# Altium project FIT_TCM.PrjPcb (part 9 of 9)
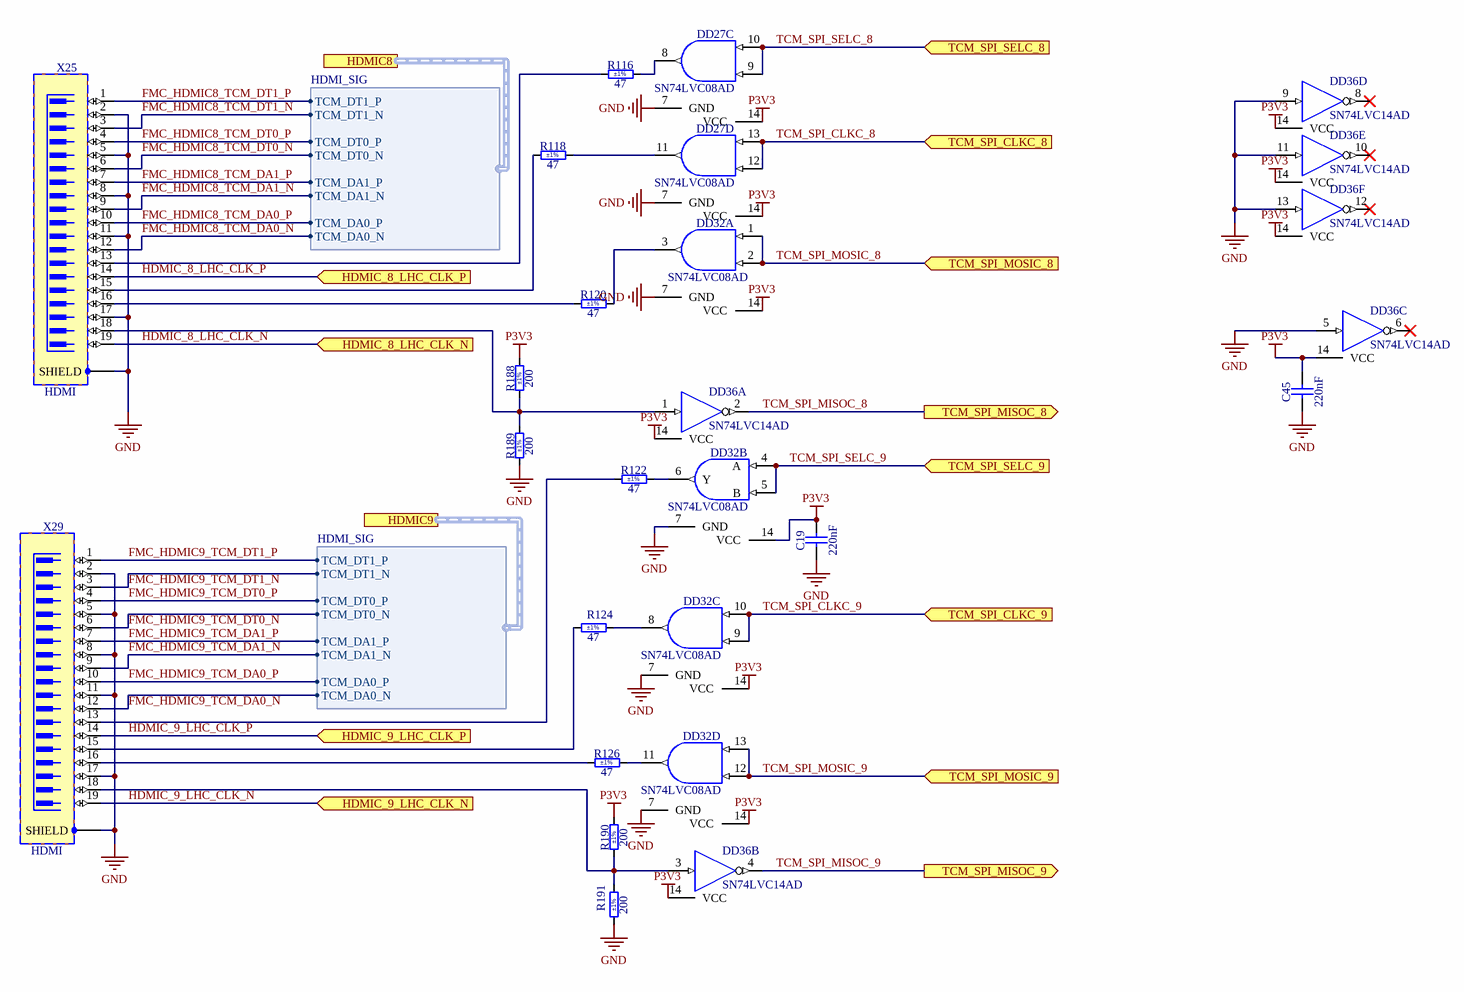
[diagram p32: FIT_HDMI_X25-29.SchDoc]

## Nets that join several sheets
GND: FIT_TCM_ATxmega (18 pins), FIT_TCM_Main_PLL (23 pins), FIT_TCM_ADCLK854 (32 pins), FIT_TCM_SI5338A (15 pins), FIT_TCM_LDO (28 pins), FIT_TCM_LOGIC (11 pins), FIT_TCM_P1V0 (15 pins), FIT_TCM_P1V8 (19 pins), FIT_TCM_P3V3 (27 pins), FIT_TCM_RJ45 (14 pins), FIT_TCM_SFP_PLUS (96 pins), FIT_TCM_LEMO_OUT (15 pins), FIT_FPGA_A-C (81 pins), FIT_FPGA_I-J-K (9 pins), FIT_FPGA_POWER (141 pins), FIT_HDMI_X19-9 (19 pins), FIT_HDMI_X32-26 (19 pins), FIT_HDMI_X22-18 (19 pins), FIT_HDMI_X31-7 (18 pins), FIT_HDMI_X27-23 (18 pins), FIT_HDMI_X21-17 (20 pins), FIT_HDMI_X34-28 (19 pins), FIT_HDMI_X24-20 (18 pins), FIT_HDMI_X16-33 (20 pins), FIT_HDMI_X25-29 (23 pins)
P1V0: FIT_TCM_P1V0 (R74.2), FIT_FPGA_POWER (27 pins)
P1V0_LDO: FIT_TCM_LDO (C78.2 R53.2), FIT_FPGA_POWER (5 pins)
P1V2_LDO: FIT_TCM_LDO (C84.2 R55.2), FIT_FPGA_I-J-K (DD6.M5 R24.1), FIT_FPGA_POWER (7 pins)
P1V8: FIT_TCM_ADCLK854 (20 pins), FIT_TCM_P1V8 (R84.2), FIT_FPGA_POWER (32 pins)
P1V8_2: FIT_TCM_LDO (L7.1), FIT_TCM_P1V8 (7 pins)
P1V8_LDO: FIT_TCM_LDO (R56.2), FIT_FPGA_POWER (C86.2 DD6.N6)
P2V5: FIT_TCM_LDO (R3.2), FIT_FPGA_POWER (7 pins)
P3V3: FIT_TCM_ATxmega (12 pins), FIT_TCM_Main_PLL (6 pins), FIT_TCM_SI5338A (6 pins), FIT_TCM_P3V3 (R92.2), FIT_TCM_RJ45 (C16.2 C27.2 DD45.8), FIT_TCM_SFP_PLUS (9 pins), FIT_TCM_LEMO_OUT (10 pins), FIT_FPGA_A-C (8 pins), FIT_FPGA_I-J-K (6 pins), FIT_FPGA_POWER (31 pins), FIT_HDMI_X19-9 (7 pins), FIT_HDMI_X32-26 (7 pins), FIT_HDMI_X22-18 (7 pins), FIT_HDMI_X31-7 (6 pins), FIT_HDMI_X27-23 (6 pins), FIT_HDMI_X21-17 (8 pins), FIT_HDMI_X34-28 (7 pins), FIT_HDMI_X24-20 (6 pins), FIT_HDMI_X16-33 (8 pins), FIT_HDMI_X25-29 (7 pins)
P3V3_2: FIT_TCM_LDO (C5.2 DA1.2 L8.1), FIT_TCM_P3V3 (7 pins)
P3V3_LDO: FIT_TCM_ATxmega (20 pins), FIT_TCM_P3V3 (C254.1 DA25.3), FIT_TCM_RJ45 (C61.1 C261.2 DD7.16)
VIN_P5V0: FIT_TCM_Main_PLL (R204.1), FIT_TCM_LDO (9 pins), FIT_TCM_LOGIC (11 pins), FIT_TCM_P1V0 (8 pins), FIT_TCM_P1V8 (11 pins), FIT_TCM_P3V3 (15 pins), FIT_TCM_RJ45 (C28.2 DD46.14 X36.1)
BUCK_SYNC: FIT_TCM_P1V0 (DA11.1), FIT_TCM_P1V8 (DA12.1 R73.2), FIT_TCM_P3V3 (DA13.1)
C_N: FIT_TCM_LEMO_OUT (DD40.3), FIT_FPGA_E_G-H (DD6.AF2)
C_P: FIT_TCM_LEMO_OUT (DD40.2), FIT_FPGA_E_G-H (DD6.AF3)
CFG_CCLK: FIT_TCM_ATxmega (DD9.6 R193.2), FIT_FPGA_I-J-K (DD6.C8)
CFG_DIN_DQ1: FIT_TCM_ATxmega (DD5.42 DD9.2), FIT_FPGA_A-C (DD6.A25)
CFG_DQ2: FIT_TCM_ATxmega (DD9.3 R36.1), FIT_FPGA_A-C (DD6.B22)
CFG_DQ3: FIT_TCM_ATxmega (DD9.7 R30.1), FIT_FPGA_A-C (DD6.A22)
CFG_FCS: FIT_TCM_ATxmega (DD5.40 DD9.1 R26.1), FIT_FPGA_A-C (DD6.C23)
CFG_MOSI_DQ0: FIT_TCM_ATxmega (DD5.41 DD9.5), FIT_FPGA_A-C (DD6.B24)
CLKA_IN_N: FIT_TCM_ADCLK854 (DD20.2 R127.1), FIT_TCM_SI5338A (DD15.17)
CLKA_IN_P: FIT_TCM_ADCLK854 (DD20.3 R127.2), FIT_TCM_SI5338A (DD15.18)
CLKA_N: FIT_TCM_ADCLK854 (DD20.15), FIT_FPGA_E_G-H (DD6.AC2)
CLKA_P: FIT_TCM_ADCLK854 (DD20.16), FIT_FPGA_E_G-H (DD6.AB2)
CLKC_IN_N: FIT_TCM_ADCLK854 (DD23.2 R172.1), FIT_TCM_SI5338A (DD15.13)
CLKC_IN_P: FIT_TCM_ADCLK854 (DD23.3 R172.2), FIT_TCM_SI5338A (DD15.14)
CLKC_N: FIT_TCM_ADCLK854 (DD23.15), FIT_FPGA_B-F (DD6.N23)
CLKC_P: FIT_TCM_ADCLK854 (DD23.16), FIT_FPGA_B-F (DD6.P23)
EN_P1V0: FIT_TCM_LOGIC (DD11.3 DD11.5 DD11.9 DD11.12), FIT_TCM_P1V0 (DA11.3)
EN_P1V0LDO_P3V3: FIT_TCM_LDO (DA3.1), FIT_TCM_LOGIC (DD11.11), FIT_TCM_P3V3 (DA13.3)
EN_P1V8: FIT_TCM_LOGIC (DD11.6), FIT_TCM_P1V8 (DA12.3)
EN_P2V5_P1V8LDO_P1V2LDO: FIT_TCM_LDO (DA1.1 DA4.1 DA5.1), FIT_TCM_LOGIC (DD11.8)
EN_PSU: FIT_TCM_ATxmega (DD5.38), FIT_TCM_LOGIC (DD11.1 DD12.4 R150.2)
ETH_RX_N: FIT_TCM_SFP_PLUS (DD41.12), FIT_FPGA_I-J-K (DD6.N3)
ETH_RX_P: FIT_TCM_SFP_PLUS (DD41.13), FIT_FPGA_I-J-K (DD6.N4)
ETH_TX_N: FIT_TCM_SFP_PLUS (DD41.19), FIT_FPGA_I-J-K (DD6.M1)
ETH_TX_P: FIT_TCM_SFP_PLUS (DD41.18), FIT_FPGA_I-J-K (DD6.M2)
EXT_CLK0_INTR: FIT_TCM_ATxmega (DD5.19 DD47.2 R132.1), FIT_TCM_SI5338A (DD15.8)
EXT_CLK0_N: FIT_TCM_Main_PLL (DD16.4), FIT_TCM_SI5338A (C8.1 R152.1)
EXT_CLK0_P: FIT_TCM_Main_PLL (DD16.5), FIT_TCM_SI5338A (C7.1 R152.2)
EXT_CLK0_STATUS: FIT_TCM_ATxmega (DD5.51), FIT_TCM_Main_PLL (DD16.9)
EXT_CLK1_INTR: FIT_TCM_ATxmega (DD5.18 DD47.1 R48.1), FIT_TCM_SI5338A (DD17.8)
EXT_CLK1_N: FIT_TCM_Main_PLL (DD16.31), FIT_TCM_SI5338A (C2.1 R4.1)
EXT_CLK1_P: FIT_TCM_Main_PLL (DD16.32), FIT_TCM_SI5338A (C1.1 R4.2)
EXT_CLK1_STATUS: FIT_TCM_ATxmega (DD5.50), FIT_TCM_Main_PLL (DD16.16)
EXT_CLK_IN_0_N: FIT_TCM_Main_PLL (DD16.11 R52.1), FIT_TCM_SFP_PLUS (DD14.12)
EXT_CLK_IN_0_P: FIT_TCM_Main_PLL (DD16.10 R52.2), FIT_TCM_SFP_PLUS (DD14.13)
EXT_CLK_SEL: FIT_TCM_ATxmega (DD5.20), FIT_TCM_Main_PLL (DD16.8)
FPGA_DONE: FIT_TCM_ATxmega (DD5.31 R23.1), FIT_TCM_LOGIC (DD13.9 DD13.10), FIT_FPGA_I-J-K (DD6.J7)
FPGA_INIT_B: FIT_TCM_ATxmega (DD5.30 R22.1), FIT_FPGA_I-J-K (DD6.G7)
FPGA_PROGRAM_B: FIT_TCM_ATxmega (DD5.27 R21.1), FIT_FPGA_I-J-K (DD6.P6)
FPGA_RST: FIT_TCM_ATxmega (DD5.13), FIT_FPGA_A-C (DD6.B21)
GBT_RX_N: FIT_TCM_SFP_PLUS (DD8.12), FIT_FPGA_I-J-K (DD6.R3)
GBT_RX_P: FIT_TCM_SFP_PLUS (DD8.13), FIT_FPGA_I-J-K (DD6.R4)
GBT_TX_N: FIT_TCM_SFP_PLUS (DD8.19), FIT_FPGA_I-J-K (DD6.P1)
GBT_TX_P: FIT_TCM_SFP_PLUS (DD8.18), FIT_FPGA_I-J-K (DD6.P2)
HDMIA0.TCM_DA0_N: FIT_FPGA_E_G-H (DD6.V7), FIT_HDMI_X31-7 (X31.12)
HDMIA0.TCM_DA0_P: FIT_FPGA_E_G-H (DD6.V8), FIT_HDMI_X31-7 (X31.10)
HDMIA0.TCM_DA1_N: FIT_FPGA_E_G-H (DD6.W9), FIT_HDMI_X31-7 (X31.9)
HDMIA0.TCM_DA1_P: FIT_FPGA_E_G-H (DD6.W10), FIT_HDMI_X31-7 (X31.7)
HDMIA0.TCM_DT0_N: FIT_FPGA_E_G-H (DD6.U1), FIT_HDMI_X31-7 (X31.6)
HDMIA0.TCM_DT0_P: FIT_FPGA_E_G-H (DD6.U2), FIT_HDMI_X31-7 (X31.4)
HDMIA0.TCM_DT1_N: FIT_FPGA_E_G-H (DD6.U5), FIT_HDMI_X31-7 (X31.3)
HDMIA0.TCM_DT1_P: FIT_FPGA_E_G-H (DD6.U6), FIT_HDMI_X31-7 (X31.1)
HDMIA1.TCM_DA0_N: FIT_FPGA_E_G-H (DD6.Y7), FIT_HDMI_X31-7 (X7.12)
HDMIA1.TCM_DA0_P: FIT_FPGA_E_G-H (DD6.Y8), FIT_HDMI_X31-7 (X7.10)
HDMIA1.TCM_DA1_N: FIT_FPGA_E_G-H (DD6.Y10), FIT_HDMI_X31-7 (X7.9)
HDMIA1.TCM_DA1_P: FIT_FPGA_E_G-H (DD6.Y11), FIT_HDMI_X31-7 (X7.7)
HDMIA1.TCM_DT0_N: FIT_FPGA_E_G-H (DD6.W3), FIT_HDMI_X31-7 (X7.6)
HDMIA1.TCM_DT0_P: FIT_FPGA_E_G-H (DD6.V3), FIT_HDMI_X31-7 (X7.4)
HDMIA1.TCM_DT1_N: FIT_FPGA_E_G-H (DD6.W5), FIT_HDMI_X31-7 (X7.3)
HDMIA1.TCM_DT1_P: FIT_FPGA_E_G-H (DD6.W6), FIT_HDMI_X31-7 (X7.1)
HDMIA2.TCM_DA0_N: FIT_FPGA_E_G-H (DD6.W8), FIT_HDMI_X22-18 (X18.12)
HDMIA2.TCM_DA0_P: FIT_FPGA_E_G-H (DD6.V9), FIT_HDMI_X22-18 (X18.10)
HDMIA2.TCM_DA1_N: FIT_FPGA_E_G-H (DD6.AF7), FIT_HDMI_X22-18 (X18.9)
HDMIA2.TCM_DA1_P: FIT_FPGA_E_G-H (DD6.AE7), FIT_HDMI_X22-18 (X18.7)
HDMIA2.TCM_DT0_N: FIT_FPGA_E_G-H (DD6.W4), FIT_HDMI_X22-18 (X18.6)
HDMIA2.TCM_DT0_P: FIT_FPGA_E_G-H (DD6.V4), FIT_HDMI_X22-18 (X18.4)
HDMIA2.TCM_DT1_N: FIT_FPGA_E_G-H (DD6.V6), FIT_HDMI_X22-18 (X18.3)
HDMIA2.TCM_DT1_P: FIT_FPGA_E_G-H (DD6.U7), FIT_HDMI_X22-18 (X18.1)
HDMIA3.TCM_DA0_N: FIT_FPGA_E_G-H (DD6.AA7), FIT_HDMI_X22-18 (X22.12)
HDMIA3.TCM_DA0_P: FIT_FPGA_E_G-H (DD6.AA8), FIT_HDMI_X22-18 (X22.10)
HDMIA3.TCM_DA1_N: FIT_FPGA_E_G-H (DD6.AD8), FIT_HDMI_X22-18 (X22.9)
HDMIA3.TCM_DA1_P: FIT_FPGA_E_G-H (DD6.AC8), FIT_HDMI_X22-18 (X22.7)
HDMIA3.TCM_DT0_N: FIT_FPGA_E_G-H (DD6.V1), FIT_HDMI_X22-18 (X22.6)
HDMIA3.TCM_DT0_P: FIT_FPGA_E_G-H (DD6.V2), FIT_HDMI_X22-18 (X22.4)
HDMIA3.TCM_DT1_N: FIT_FPGA_E_G-H (DD6.Y2), FIT_HDMI_X22-18 (X22.3)
HDMIA3.TCM_DT1_P: FIT_FPGA_E_G-H (DD6.Y3), FIT_HDMI_X22-18 (X22.1)
HDMIA4.TCM_DA0_N: FIT_FPGA_E_G-H (DD6.AC7), FIT_HDMI_X32-26 (X26.12)
HDMIA4.TCM_DA0_P: FIT_FPGA_E_G-H (DD6.AB7), FIT_HDMI_X32-26 (X26.10)
HDMIA4.TCM_DA1_N: FIT_FPGA_E_G-H (DD6.AB9), FIT_HDMI_X32-26 (X26.9)
HDMIA4.TCM_DA1_P: FIT_FPGA_E_G-H (DD6.AA9), FIT_HDMI_X32-26 (X26.7)
HDMIA4.TCM_DT0_N: FIT_FPGA_E_G-H (DD6.Y1), FIT_HDMI_X32-26 (X26.6)
HDMIA4.TCM_DT0_P: FIT_FPGA_E_G-H (DD6.W1), FIT_HDMI_X32-26 (X26.4)
HDMIA4.TCM_DT1_N: FIT_FPGA_E_G-H (DD6.AC1), FIT_HDMI_X32-26 (X26.3)
HDMIA4.TCM_DT1_P: FIT_FPGA_E_G-H (DD6.AB1), FIT_HDMI_X32-26 (X26.1)
HDMIA5.TCM_DA0_N: FIT_FPGA_E_G-H (DD6.AE13), FIT_HDMI_X32-26 (X32.12)
HDMIA5.TCM_DA0_P: FIT_FPGA_E_G-H (DD6.AF13), FIT_HDMI_X32-26 (X32.10)
HDMIA5.TCM_DA1_N: FIT_FPGA_E_G-H (DD6.AC11), FIT_HDMI_X32-26 (X32.9)
HDMIA5.TCM_DA1_P: FIT_FPGA_E_G-H (DD6.AB11), FIT_HDMI_X32-26 (X32.7)
HDMIA5.TCM_DT0_N: FIT_FPGA_E_G-H (DD6.AB4), FIT_HDMI_X32-26 (X32.6)
HDMIA5.TCM_DT0_P: FIT_FPGA_E_G-H (DD6.AA4), FIT_HDMI_X32-26 (X32.4)
HDMIA5.TCM_DT1_N: FIT_FPGA_E_G-H (DD6.AA2), FIT_HDMI_X32-26 (X32.3)
HDMIA5.TCM_DT1_P: FIT_FPGA_E_G-H (DD6.AA3), FIT_HDMI_X32-26 (X32.1)
HDMIA6.TCM_DA0_N: FIT_FPGA_E_G-H (DD6.AB10), FIT_HDMI_X19-9 (X9.12)
HDMIA6.TCM_DA0_P: FIT_FPGA_E_G-H (DD6.AA10), FIT_HDMI_X19-9 (X9.10)
HDMIA6.TCM_DA1_N: FIT_FPGA_E_G-H (DD6.AC12), FIT_HDMI_X19-9 (X9.9)
HDMIA6.TCM_DA1_P: FIT_FPGA_E_G-H (DD6.AB12), FIT_HDMI_X19-9 (X9.7)
HDMIA6.TCM_DT0_N: FIT_FPGA_E_G-H (DD6.AB5), FIT_HDMI_X19-9 (X9.6)
HDMIA6.TCM_DT0_P: FIT_FPGA_E_G-H (DD6.AA5), FIT_HDMI_X19-9 (X9.4)
HDMIA6.TCM_DT1_N: FIT_FPGA_E_G-H (DD6.AC3), FIT_HDMI_X19-9 (X9.3)
HDMIA6.TCM_DT1_P: FIT_FPGA_E_G-H (DD6.AC4), FIT_HDMI_X19-9 (X9.1)
HDMIA7.TCM_DA0_N: FIT_FPGA_E_G-H (DD6.AA12), FIT_HDMI_X19-9 (X19.12)
HDMIA7.TCM_DA0_P: FIT_FPGA_E_G-H (DD6.AA13), FIT_HDMI_X19-9 (X19.10)
HDMIA7.TCM_DA1_N: FIT_FPGA_E_G-H (DD6.AD13), FIT_HDMI_X19-9 (X19.9)
HDMIA7.TCM_DA1_P: FIT_FPGA_E_G-H (DD6.AC13), FIT_HDMI_X19-9 (X19.7)
HDMIA7.TCM_DT0_N: FIT_FPGA_E_G-H (DD6.Y5), FIT_HDMI_X19-9 (X19.6)
HDMIA7.TCM_DT0_P: FIT_FPGA_E_G-H (DD6.Y6), FIT_HDMI_X19-9 (X19.4)
HDMIA7.TCM_DT1_N: FIT_FPGA_E_G-H (DD6.AC6), FIT_HDMI_X19-9 (X19.3)
HDMIA7.TCM_DT1_P: FIT_FPGA_E_G-H (DD6.AB6), FIT_HDMI_X19-9 (X19.1)
HDMIA8.TCM_DA0_N: FIT_FPGA_E_G-H (DD6.Y12), FIT_HDMI_X27-23 (x23.12)
HDMIA8.TCM_DA0_P: FIT_FPGA_E_G-H (DD6.Y13), FIT_HDMI_X27-23 (x23.10)
HDMIA8.TCM_DA1_N: FIT_FPGA_E_G-H (DD6.AE11), FIT_HDMI_X27-23 (x23.9)
HDMIA8.TCM_DA1_P: FIT_FPGA_E_G-H (DD6.AD11), FIT_HDMI_X27-23 (x23.7)
HDMIA8.TCM_DT0_N: FIT_FPGA_E_G-H (DD6.AD3), FIT_HDMI_X27-23 (x23.6)
HDMIA8.TCM_DT0_P: FIT_FPGA_E_G-H (DD6.AD4), FIT_HDMI_X27-23 (x23.4)
HDMIA8.TCM_DT1_N: FIT_FPGA_E_G-H (DD6.AD5), FIT_HDMI_X27-23 (x23.3)
HDMIA8.TCM_DT1_P: FIT_FPGA_E_G-H (DD6.AD6), FIT_HDMI_X27-23 (x23.1)
HDMIA9.TCM_DA0_N: FIT_FPGA_E_G-H (DD6.AE10), FIT_HDMI_X27-23 (x27.12)
HDMIA9.TCM_DA0_P: FIT_FPGA_E_G-H (DD6.AD10), FIT_HDMI_X27-23 (x27.10)
HDMIA9.TCM_DA1_N: FIT_FPGA_E_G-H (DD6.AF12), FIT_HDMI_X27-23 (x27.9)
HDMIA9.TCM_DA1_P: FIT_FPGA_E_G-H (DD6.AE12), FIT_HDMI_X27-23 (x27.7)
HDMIA9.TCM_DT0_N: FIT_FPGA_E_G-H (DD6.AF4), FIT_HDMI_X27-23 (x27.6)
HDMIA9.TCM_DT0_P: FIT_FPGA_E_G-H (DD6.AF5), FIT_HDMI_X27-23 (x27.4)
HDMIA9.TCM_DT1_N: FIT_FPGA_E_G-H (DD6.AE1), FIT_HDMI_X27-23 (x27.3)
HDMIA9.TCM_DT1_P: FIT_FPGA_E_G-H (DD6.AD1), FIT_HDMI_X27-23 (x27.1)
HDMIA_LHC.0_LHC_CLK_N: FIT_TCM_ADCLK854 (DD20.47), FIT_HDMI_X31-7 (X31.19)
HDMIA_LHC.0_LHC_CLK_P: FIT_TCM_ADCLK854 (DD20.48), FIT_HDMI_X31-7 (X31.14)
HDMIA_LHC.1_LHC_CLK_N: FIT_TCM_ADCLK854 (DD20.45), FIT_HDMI_X31-7 (X7.19)
HDMIA_LHC.1_LHC_CLK_P: FIT_TCM_ADCLK854 (DD20.46), FIT_HDMI_X31-7 (X7.14)
HDMIA_LHC.2_LHC_CLK_N: FIT_TCM_ADCLK854 (DD20.41), FIT_HDMI_X22-18 (X18.19)
HDMIA_LHC.2_LHC_CLK_P: FIT_TCM_ADCLK854 (DD20.42), FIT_HDMI_X22-18 (X18.14)
HDMIA_LHC.3_LHC_CLK_N: FIT_TCM_ADCLK854 (DD20.39), FIT_HDMI_X22-18 (X22.19)
HDMIA_LHC.3_LHC_CLK_P: FIT_TCM_ADCLK854 (DD20.40), FIT_HDMI_X22-18 (X22.14)
HDMIA_LHC.4_LHC_CLK_N: FIT_TCM_ADCLK854 (DD20.33), FIT_HDMI_X32-26 (X26.19)
HDMIA_LHC.4_LHC_CLK_P: FIT_TCM_ADCLK854 (DD20.34), FIT_HDMI_X32-26 (X26.14)
HDMIA_LHC.5_LHC_CLK_N: FIT_TCM_ADCLK854 (DD20.31), FIT_HDMI_X32-26 (X32.19)
HDMIA_LHC.5_LHC_CLK_P: FIT_TCM_ADCLK854 (DD20.32), FIT_HDMI_X32-26 (X32.14)
HDMIA_LHC.6_LHC_CLK_N: FIT_TCM_ADCLK854 (DD20.27), FIT_HDMI_X19-9 (X9.19)
HDMIA_LHC.6_LHC_CLK_P: FIT_TCM_ADCLK854 (DD20.28), FIT_HDMI_X19-9 (X9.14)
HDMIA_LHC.7_LHC_CLK_N: FIT_TCM_ADCLK854 (DD20.25), FIT_HDMI_X19-9 (X19.19)
HDMIA_LHC.7_LHC_CLK_P: FIT_TCM_ADCLK854 (DD20.26), FIT_HDMI_X19-9 (X19.14)
HDMIA_LHC.8_LHC_CLK_N: FIT_TCM_ADCLK854 (DD20.21), FIT_HDMI_X27-23 (x23.19)
HDMIA_LHC.8_LHC_CLK_P: FIT_TCM_ADCLK854 (DD20.22), FIT_HDMI_X27-23 (x23.14)
HDMIA_LHC.9_LHC_CLK_N: FIT_TCM_ADCLK854 (DD20.19), FIT_HDMI_X27-23 (x27.19)
HDMIA_LHC.9_LHC_CLK_P: FIT_TCM_ADCLK854 (DD20.20), FIT_HDMI_X27-23 (x27.14)
HDMIC0.TCM_DA0_N: FIT_FPGA_B-F (DD6.P26), FIT_HDMI_X16-33 (X33.12)
HDMIC0.TCM_DA0_P: FIT_FPGA_B-F (DD6.R26), FIT_HDMI_X16-33 (X33.10)
HDMIC0.TCM_DA1_N: FIT_FPGA_B-F (DD6.K26), FIT_HDMI_X16-33 (X33.9)
HDMIC0.TCM_DA1_P: FIT_FPGA_B-F (DD6.K25), FIT_HDMI_X16-33 (X33.7)
HDMIC0.TCM_DT0_N: FIT_FPGA_B-F (DD6.AF15), FIT_HDMI_X16-33 (X33.6)
HDMIC0.TCM_DT0_P: FIT_FPGA_B-F (DD6.AF14), FIT_HDMI_X16-33 (X33.4)
HDMIC0.TCM_DT1_N: FIT_FPGA_B-F (DD6.AF17), FIT_HDMI_X16-33 (X33.3)
HDMIC0.TCM_DT1_P: FIT_FPGA_B-F (DD6.AE17), FIT_HDMI_X16-33 (X33.1)
HDMIC1.TCM_DA0_N: FIT_FPGA_B-F (DD6.N24), FIT_HDMI_X16-33 (X16.12)
HDMIC1.TCM_DA0_P: FIT_FPGA_B-F (DD6.P24), FIT_HDMI_X16-33 (X16.10)
HDMIC1.TCM_DA1_N: FIT_FPGA_B-F (DD6.L25), FIT_HDMI_X16-33 (X16.9)
HDMIC1.TCM_DA1_P: FIT_FPGA_B-F (DD6.M25), FIT_HDMI_X16-33 (X16.7)
HDMIC1.TCM_DT0_N: FIT_FPGA_B-F (DD6.AE15), FIT_HDMI_X16-33 (X16.6)
HDMIC1.TCM_DT0_P: FIT_FPGA_B-F (DD6.AD15), FIT_HDMI_X16-33 (X16.4)
HDMIC1.TCM_DT1_N: FIT_FPGA_B-F (DD6.AF18), FIT_HDMI_X16-33 (X16.3)
HDMIC1.TCM_DT1_P: FIT_FPGA_B-F (DD6.AE18), FIT_HDMI_X16-33 (X16.1)
HDMIC2.TCM_DA0_N: FIT_FPGA_B-F (DD6.P25), FIT_HDMI_X24-20 (X20.12)
HDMIC2.TCM_DA0_P: FIT_FPGA_B-F (DD6.R25), FIT_HDMI_X24-20 (X20.10)
HDMIC2.TCM_DA1_N: FIT_FPGA_B-F (DD6.M26), FIT_HDMI_X24-20 (X20.9)
HDMIC2.TCM_DA1_P: FIT_FPGA_B-F (DD6.N26), FIT_HDMI_X24-20 (X20.7)
HDMIC2.TCM_DT0_N: FIT_FPGA_B-F (DD6.AE16), FIT_HDMI_X24-20 (X20.6)
HDMIC2.TCM_DT0_P: FIT_FPGA_B-F (DD6.AD16), FIT_HDMI_X24-20 (X20.4)
HDMIC2.TCM_DT1_N: FIT_FPGA_B-F (DD6.AF20), FIT_HDMI_X24-20 (X20.3)
HDMIC2.TCM_DT1_P: FIT_FPGA_B-F (DD6.AF19), FIT_HDMI_X24-20 (X20.1)
HDMIC3.TCM_DA0_N: FIT_FPGA_B-F (DD6.L24), FIT_HDMI_X24-20 (X24.12)
HDMIC3.TCM_DA0_P: FIT_FPGA_B-F (DD6.M24), FIT_HDMI_X24-20 (X24.10)
HDMIC3.TCM_DA1_N: FIT_FPGA_B-F (DD6.M20), FIT_HDMI_X24-20 (X24.9)
HDMIC3.TCM_DA1_P: FIT_FPGA_B-F (DD6.N19), FIT_HDMI_X24-20 (X24.7)
HDMIC3.TCM_DT0_N: FIT_FPGA_B-F (DD6.AD14), FIT_HDMI_X24-20 (X24.6)
HDMIC3.TCM_DT0_P: FIT_FPGA_B-F (DD6.AC14), FIT_HDMI_X24-20 (X24.4)
HDMIC3.TCM_DT1_N: FIT_FPGA_B-F (DD6.AA15), FIT_HDMI_X24-20 (X24.3)
HDMIC3.TCM_DT1_P: FIT_FPGA_B-F (DD6.AA14), FIT_HDMI_X24-20 (X24.1)
HDMIC4.TCM_DA0_N: FIT_FPGA_B-F (DD6.M22), FIT_HDMI_X34-28 (X28.12)
HDMIC4.TCM_DA0_P: FIT_FPGA_B-F (DD6.M21), FIT_HDMI_X34-28 (X28.10)
HDMIC4.TCM_DA1_N: FIT_FPGA_B-F (DD6.P20), FIT_HDMI_X34-28 (X28.9)
HDMIC4.TCM_DA1_P: FIT_FPGA_B-F (DD6.P19), FIT_HDMI_X34-28 (X28.7)
HDMIC4.TCM_DT0_N: FIT_FPGA_B-F (DD6.AB15), FIT_HDMI_X34-28 (X28.6)
HDMIC4.TCM_DT0_P: FIT_FPGA_B-F (DD6.AB14), FIT_HDMI_X34-28 (X28.4)
HDMIC4.TCM_DT1_N: FIT_FPGA_B-F (DD6.Y16), FIT_HDMI_X34-28 (X28.3)
HDMIC4.TCM_DT1_P: FIT_FPGA_B-F (DD6.Y15), FIT_HDMI_X34-28 (X28.1)
HDMIC5.TCM_DA0_N: FIT_FPGA_B-F (DD6.P21), FIT_HDMI_X34-28 (X34.12)
HDMIC5.TCM_DA0_P: FIT_FPGA_B-F (DD6.R21), FIT_HDMI_X34-28 (X34.10)
HDMIC5.TCM_DA1_N: FIT_FPGA_B-F (DD6.N22), FIT_HDMI_X34-28 (X34.9)
HDMIC5.TCM_DA1_P: FIT_FPGA_B-F (DD6.N21), FIT_HDMI_X34-28 (X34.7)
HDMIC5.TCM_DT0_N: FIT_FPGA_B-F (DD6.AC16), FIT_HDMI_X34-28 (X34.6)
HDMIC5.TCM_DT0_P: FIT_FPGA_B-F (DD6.AB16), FIT_HDMI_X34-28 (X34.4)
HDMIC5.TCM_DT1_N: FIT_FPGA_B-F (DD6.AA18), FIT_HDMI_X34-28 (X34.3)
HDMIC5.TCM_DT1_P: FIT_FPGA_B-F (DD6.AA17), FIT_HDMI_X34-28 (X34.1)
HDMIC6.TCM_DA0_N: FIT_FPGA_B-F (DD6.T25), FIT_HDMI_X21-17 (X17.12)
HDMIC6.TCM_DA0_P: FIT_FPGA_B-F (DD6.T24), FIT_HDMI_X21-17 (X17.10)
HDMIC6.TCM_DA1_N: FIT_FPGA_B-F (DD6.R23), FIT_HDMI_X21-17 (X17.9)
HDMIC6.TCM_DA1_P: FIT_FPGA_B-F (DD6.R22), FIT_HDMI_X21-17 (X17.7)
HDMIC6.TCM_DT0_N: FIT_FPGA_B-F (DD6.AC17), FIT_HDMI_X21-17 (X17.6)
HDMIC6.TCM_DT0_P: FIT_FPGA_B-F (DD6.AB17), FIT_HDMI_X21-17 (X17.4)
HDMIC6.TCM_DT1_N: FIT_FPGA_B-F (DD6.AD18), FIT_HDMI_X21-17 (X17.3)
HDMIC6.TCM_DT1_P: FIT_FPGA_B-F (DD6.AC18), FIT_HDMI_X21-17 (X17.1)
HDMIC7.TCM_DA0_N: FIT_FPGA_B-F (DD6.T23), FIT_HDMI_X21-17 (X21.12)
HDMIC7.TCM_DA0_P: FIT_FPGA_B-F (DD6.T22), FIT_HDMI_X21-17 (X21.10)
HDMIC7.TCM_DA1_N: FIT_FPGA_B-F (DD6.R20), FIT_HDMI_X21-17 (X21.9)
HDMIC7.TCM_DA1_P: FIT_FPGA_B-F (DD6.T20), FIT_HDMI_X21-17 (X21.7)
HDMIC7.TCM_DT0_N: FIT_FPGA_B-F (DD6.AA20), FIT_HDMI_X21-17 (X21.6)
HDMIC7.TCM_DT0_P: FIT_FPGA_B-F (DD6.AA19), FIT_HDMI_X21-17 (X21.4)
HDMIC7.TCM_DT1_N: FIT_FPGA_B-F (DD6.AE20), FIT_HDMI_X21-17 (X21.3)
HDMIC7.TCM_DT1_P: FIT_FPGA_B-F (DD6.AD20), FIT_HDMI_X21-17 (X21.1)
HDMIC8.TCM_DA0_N: FIT_FPGA_B-F (DD6.T19), FIT_HDMI_X25-29 (X25.12)
HDMIC8.TCM_DA0_P: FIT_FPGA_B-F (DD6.T18), FIT_HDMI_X25-29 (X25.10)
HDMIC8.TCM_DA1_N: FIT_FPGA_B-F (DD6.U20), FIT_HDMI_X25-29 (X25.9)
HDMIC8.TCM_DA1_P: FIT_FPGA_B-F (DD6.U19), FIT_HDMI_X25-29 (X25.7)
HDMIC8.TCM_DT0_N: FIT_FPGA_B-F (DD6.AB20), FIT_HDMI_X25-29 (X25.6)
HDMIC8.TCM_DT0_P: FIT_FPGA_B-F (DD6.AB19), FIT_HDMI_X25-29 (X25.4)
HDMIC8.TCM_DT1_N: FIT_FPGA_B-F (DD6.AD19), FIT_HDMI_X25-29 (X25.3)
HDMIC8.TCM_DT1_P: FIT_FPGA_B-F (DD6.AC19), FIT_HDMI_X25-29 (X25.1)
HDMIC9.TCM_DA0_N: FIT_FPGA_B-F (DD6.R17), FIT_HDMI_X25-29 (X29.12)
HDMIC9.TCM_DA0_P: FIT_FPGA_B-F (DD6.R16), FIT_HDMI_X25-29 (X29.10)
HDMIC9.TCM_DA1_N: FIT_FPGA_B-F (DD6.N17), FIT_HDMI_X25-29 (X29.9)
HDMIC9.TCM_DA1_P: FIT_FPGA_B-F (DD6.P16), FIT_HDMI_X25-29 (X29.7)
HDMIC9.TCM_DT0_N: FIT_FPGA_B-F (DD6.V17), FIT_HDMI_X25-29 (X29.6)
HDMIC9.TCM_DT0_P: FIT_FPGA_B-F (DD6.V16), FIT_HDMI_X25-29 (X29.4)
HDMIC9.TCM_DT1_N: FIT_FPGA_B-F (DD6.Y18), FIT_HDMI_X25-29 (X29.3)
HDMIC9.TCM_DT1_P: FIT_FPGA_B-F (DD6.Y17), FIT_HDMI_X25-29 (X29.1)
HDMIC_LHC.0_LHC_CLK_N: FIT_TCM_ADCLK854 (DD23.47), FIT_HDMI_X16-33 (X33.19)
HDMIC_LHC.0_LHC_CLK_P: FIT_TCM_ADCLK854 (DD23.48), FIT_HDMI_X16-33 (X33.14)
HDMIC_LHC.1_LHC_CLK_N: FIT_TCM_ADCLK854 (DD23.45), FIT_HDMI_X16-33 (X16.19)
HDMIC_LHC.1_LHC_CLK_P: FIT_TCM_ADCLK854 (DD23.46), FIT_HDMI_X16-33 (X16.14)
HDMIC_LHC.2_LHC_CLK_N: FIT_TCM_ADCLK854 (DD23.41), FIT_HDMI_X24-20 (X20.19)
HDMIC_LHC.2_LHC_CLK_P: FIT_TCM_ADCLK854 (DD23.42), FIT_HDMI_X24-20 (X20.14)
HDMIC_LHC.3_LHC_CLK_N: FIT_TCM_ADCLK854 (DD23.39), FIT_HDMI_X24-20 (X24.19)
HDMIC_LHC.3_LHC_CLK_P: FIT_TCM_ADCLK854 (DD23.40), FIT_HDMI_X24-20 (X24.14)
HDMIC_LHC.4_LHC_CLK_N: FIT_TCM_ADCLK854 (DD23.33), FIT_HDMI_X34-28 (X28.19)
HDMIC_LHC.4_LHC_CLK_P: FIT_TCM_ADCLK854 (DD23.34), FIT_HDMI_X34-28 (X28.14)
HDMIC_LHC.5_LHC_CLK_N: FIT_TCM_ADCLK854 (DD23.31), FIT_HDMI_X34-28 (X34.19)
HDMIC_LHC.5_LHC_CLK_P: FIT_TCM_ADCLK854 (DD23.32), FIT_HDMI_X34-28 (X34.14)
HDMIC_LHC.6_LHC_CLK_N: FIT_TCM_ADCLK854 (DD23.27), FIT_HDMI_X21-17 (X17.19)
HDMIC_LHC.6_LHC_CLK_P: FIT_TCM_ADCLK854 (DD23.28), FIT_HDMI_X21-17 (X17.14)
HDMIC_LHC.7_LHC_CLK_N: FIT_TCM_ADCLK854 (DD23.25), FIT_HDMI_X21-17 (X21.19)
HDMIC_LHC.7_LHC_CLK_P: FIT_TCM_ADCLK854 (DD23.26), FIT_HDMI_X21-17 (X21.14)
HDMIC_LHC.8_LHC_CLK_N: FIT_TCM_ADCLK854 (DD23.21), FIT_HDMI_X25-29 (X25.19)
HDMIC_LHC.8_LHC_CLK_P: FIT_TCM_ADCLK854 (DD23.22), FIT_HDMI_X25-29 (X25.14)
HDMIC_LHC.9_LHC_CLK_N: FIT_TCM_ADCLK854 (DD23.19), FIT_HDMI_X25-29 (X29.19)
HDMIC_LHC.9_LHC_CLK_P: FIT_TCM_ADCLK854 (DD23.20), FIT_HDMI_X25-29 (X29.14)
IN_PWR_OK: FIT_TCM_ATxmega (DD5.37 R109.1), FIT_TCM_LOGIC (5 pins), FIT_TCM_P3V3 (DA21.3)
LAS_N: FIT_TCM_Main_PLL (DD43.3), FIT_FPGA_E_G-H (DD6.AF9)
LAS_P: FIT_TCM_Main_PLL (DD43.2), FIT_FPGA_E_G-H (DD6.AF10)
LASER_EN: FIT_TCM_ATxmega (DD5.10), FIT_TCM_Main_PLL (DD44.1 DD44.4 DD44.10 DD44.13)
LCLK_N: FIT_TCM_Main_PLL (DD43.7), FIT_TCM_SI5338A (DD15.21), FIT_FPGA_E_G-H (DD6.AD9)
LCLK_P: FIT_TCM_Main_PLL (DD43.6), FIT_TCM_SI5338A (DD15.22), FIT_FPGA_E_G-H (DD6.AC9)
MCU_ATT_A: FIT_TCM_ATxmega (DD5.6), FIT_TCM_RJ45 (DD46.1 DD46.2)
MCU_ATT_B: FIT_TCM_ATxmega (DD5.7), FIT_TCM_RJ45 (DD46.4 DD46.5)
MCU_ATT_C: FIT_TCM_ATxmega (DD5.8), FIT_TCM_RJ45 (DD46.9 DD46.10)
MCU_ATT_D: FIT_TCM_ATxmega (DD5.9), FIT_TCM_RJ45 (DD46.12 DD46.13)
MCU_Att_Rx: FIT_TCM_ATxmega (DD5.28), FIT_TCM_RJ45 (DD45.4)
MCU_Att_Tx: FIT_TCM_ATxmega (DD5.29), FIT_TCM_RJ45 (DD45.5)
MCU_Console_CTS: FIT_TCM_ATxmega (DD5.47), FIT_TCM_RJ45 (DD7.9)
MCU_Console_RTS: FIT_TCM_ATxmega (DD5.46), FIT_TCM_RJ45 (DD7.10)
MCU_Console_Rx: FIT_TCM_ATxmega (DD5.48), FIT_TCM_RJ45 (DD7.12)
MCU_Console_Tx: FIT_TCM_ATxmega (DD5.49), FIT_TCM_RJ45 (DD7.11)
MCU_CS: FIT_TCM_ATxmega (DD5.26), FIT_FPGA_A-C (DD6.B20)
MCU_IRQ: FIT_TCM_ATxmega (DD5.36), FIT_FPGA_A-C (DD6.A20)
MCU_MISO: FIT_TCM_ATxmega (DD5.22), FIT_FPGA_A-C (DD6.D21)
MCU_MOSI: FIT_TCM_ATxmega (DD5.21), FIT_FPGA_A-C (DD6.C21)
MCU_SCK: FIT_TCM_ATxmega (DD5.23), FIT_FPGA_A-C (DD6.D23)
MCU_SCL: FIT_TCM_ATxmega (DD5.17), FIT_TCM_SI5338A (DD15.12 DD17.12 R27.1)
MCU_SDA: FIT_TCM_ATxmega (DD5.16), FIT_TCM_SI5338A (DD15.19 DD17.19 R137.1)
MGTCLK_N: FIT_TCM_SI5338A (DD17.22), FIT_FPGA_I-J-K (C70.1)
MGTCLK_P: FIT_TCM_SI5338A (DD17.21), FIT_FPGA_I-J-K (C69.1)
OrA_N: FIT_TCM_LEMO_OUT (DD28.3), FIT_FPGA_E_G-H (DD6.AE2)
OrA_P: FIT_TCM_LEMO_OUT (DD28.2), FIT_FPGA_E_G-H (DD6.AE3)
OrB_N: FIT_TCM_LEMO_OUT (DD37.3), FIT_FPGA_E_G-H (DD6.AF8)
OrB_P: FIT_TCM_LEMO_OUT (DD37.2), FIT_FPGA_E_G-H (DD6.AE8)
OVERTEMPn: FIT_TCM_ATxmega (DA27.6 R151.1), FIT_TCM_LOGIC (DD30.4)
P1V0_PG: FIT_TCM_LOGIC (DD11.4 DD30.5), FIT_TCM_P1V0 (DA11.17 R79.1)
P1V0LDO_P3V3_PG: FIT_TCM_LDO (DA14.1 DA14.6), FIT_TCM_LOGIC (DD11.10 DD30.6 R97.1), FIT_TCM_P3V3 (DA13.17)
P1V8_PG: FIT_TCM_LOGIC (DD11.13 DD30.12), FIT_TCM_P1V8 (DA12.17 R89.1)
P2V5_P1V8LDO_P1V2LDO_PG: FIT_TCM_ATxmega (DD5.39 R112.1), FIT_TCM_LDO (6 pins), FIT_TCM_LOGIC (DD13.4 DD13.5 DD30.11)
SC_N: FIT_TCM_LEMO_OUT (DD39.3), FIT_FPGA_E_G-H (DD6.AE5)
SC_P: FIT_TCM_LEMO_OUT (DD39.2), FIT_FPGA_E_G-H (DD6.AE6)
TCM_SPI_CLKA_0: FPGA_SPI (DD6.F8), FIT_HDMI_X31-7 (DD42.4 DD42.5)
TCM_SPI_CLKA_1: FPGA_SPI (DD6.G9), FIT_HDMI_X31-7 (DD2.1 DD2.2)
TCM_SPI_CLKA_2: FPGA_SPI (DD6.B9), FIT_HDMI_X22-18 (DD2.12 DD2.13)
TCM_SPI_CLKA_3: FPGA_SPI (DD6.F10), FIT_HDMI_X22-18 (DD3.9 DD3.10)
TCM_SPI_CLKA_4: FPGA_SPI (DD6.A10), FIT_HDMI_X32-26 (DD4.4 DD4.5)
TCM_SPI_CLKA_5: FPGA_SPI (DD6.E11), FIT_HDMI_X32-26 (DD24.1 DD24.2)
TCM_SPI_CLKA_6: FPGA_SPI (DD6.H12), FIT_HDMI_X19-9 (DD24.12 DD24.13)
TCM_SPI_CLKA_7: FPGA_SPI (DD6.C12), FIT_HDMI_X19-9 (DD26.9 DD26.10)
TCM_SPI_CLKA_8: FPGA_SPI (DD6.H13), FIT_HDMI_X27-23 (DD29.4 DD29.5)
TCM_SPI_CLKA_9: FPGA_SPI (DD6.C13), FIT_HDMI_X27-23 (DD31.1 DD31.2)
TCM_SPI_CLKC_0: FPGA_SPI (DD6.G14), FIT_HDMI_X16-33 (DD31.12 DD31.13)
TCM_SPI_CLKC_1: FPGA_SPI (DD6.B14), FIT_HDMI_X16-33 (DD18.9 DD18.10)
TCM_SPI_CLKC_2: FPGA_SPI (DD6.G15), FIT_HDMI_X24-20 (DD19.4 DD19.5)
TCM_SPI_CLKC_3: FPGA_SPI (DD6.B15), FIT_HDMI_X24-20 (DD21.1 DD21.2)
TCM_SPI_CLKC_4: FPGA_SPI (DD6.J16), FIT_HDMI_X34-28 (DD21.12 DD21.13)
TCM_SPI_CLKC_5: FPGA_SPI (DD6.D16), FIT_HDMI_X34-28 (DD22.9 DD22.10)
TCM_SPI_CLKC_6: FPGA_SPI (DD6.L17), FIT_HDMI_X21-17 (DD25.4 DD25.5)
TCM_SPI_CLKC_7: FPGA_SPI (DD6.F17), FIT_HDMI_X21-17 (DD27.1 DD27.2)
TCM_SPI_CLKC_8: FPGA_SPI (DD6.A17), FIT_HDMI_X25-29 (DD27.12 DD27.13)
TCM_SPI_CLKC_9: FPGA_SPI (DD6.H18), FIT_HDMI_X25-29 (DD32.9 DD32.10)
TCM_SPI_MISOA_0: FPGA_SPI (DD6.J8), FIT_HDMI_X31-7 (DD33.2)
TCM_SPI_MISOA_1: FPGA_SPI (DD6.A8), FIT_HDMI_X31-7 (DD33.4)
TCM_SPI_MISOA_2: FPGA_SPI (DD6.D9), FIT_HDMI_X22-18 (DD33.6)
TCM_SPI_MISOA_3: FPGA_SPI (DD6.J10), FIT_HDMI_X22-18 (DD33.8)
TCM_SPI_MISOA_4: FPGA_SPI (DD6.D10), FIT_HDMI_X32-26 (DD33.10)
TCM_SPI_MISOA_5: FPGA_SPI (DD6.H11), FIT_HDMI_X32-26 (DD33.12)
TCM_SPI_MISOA_6: FPGA_SPI (DD6.C11), FIT_HDMI_X19-9 (DD34.2)
TCM_SPI_MISOA_7: FPGA_SPI (DD6.F12), FIT_HDMI_X19-9 (DD34.4)
TCM_SPI_MISOA_8: FPGA_SPI (DD6.A12), FIT_HDMI_X27-23 (DD34.6)
TCM_SPI_MISOA_9: FPGA_SPI (DD6.E13), FIT_HDMI_X27-23 (DD34.8)
TCM_SPI_MISOC_0: FPGA_SPI (DD6.J14), FIT_HDMI_X16-33 (DD34.10)
TCM_SPI_MISOC_1: FPGA_SPI (DD6.D14), FIT_HDMI_X16-33 (DD34.12)
TCM_SPI_MISOC_2: FPGA_SPI (DD6.K15), FIT_HDMI_X24-20 (DD35.2)
TCM_SPI_MISOC_3: FPGA_SPI (DD6.E15), FIT_HDMI_X24-20 (DD35.4)
TCM_SPI_MISOC_4: FPGA_SPI (DD6.M16), FIT_HDMI_X34-28 (DD35.6)
TCM_SPI_MISOC_5: FPGA_SPI (DD6.G16), FIT_HDMI_X34-28 (DD35.8)
TCM_SPI_MISOC_6: FPGA_SPI (DD6.B16), FIT_HDMI_X21-17 (DD35.10)
TCM_SPI_MISOC_7: FPGA_SPI (DD6.H17), FIT_HDMI_X21-17 (DD35.12)
TCM_SPI_MISOC_8: FPGA_SPI (DD6.C17), FIT_HDMI_X25-29 (DD36.2)
TCM_SPI_MISOC_9: FPGA_SPI (DD6.K18), FIT_HDMI_X25-29 (DD36.4)
TCM_SPI_MOSIA_0: FPGA_SPI (DD6.H8), FIT_HDMI_X31-7 (DD42.9 DD42.10)
TCM_SPI_MOSIA_1: FPGA_SPI (DD6.H9), FIT_HDMI_X31-7 (DD2.4 DD2.5)
TCM_SPI_MOSIA_2: FPGA_SPI (DD6.C9), FIT_HDMI_X22-18 (DD3.1 DD3.2)
TCM_SPI_MOSIA_3: FPGA_SPI (DD6.G10), FIT_HDMI_X22-18 (DD3.12 DD3.13)
TCM_SPI_MOSIA_4: FPGA_SPI (DD6.B10), FIT_HDMI_X32-26 (DD4.9 DD4.10)
TCM_SPI_MOSIA_5: FPGA_SPI (DD6.G11), FIT_HDMI_X32-26 (DD24.4 DD24.5)
TCM_SPI_MOSIA_6: FPGA_SPI (DD6.B11), FIT_HDMI_X19-9 (DD26.1 DD26.2)
TCM_SPI_MOSIA_7: FPGA_SPI (DD6.E12), FIT_HDMI_X19-9 (DD26.12 DD26.13)
TCM_SPI_MOSIA_8: FPGA_SPI (DD6.J13), FIT_HDMI_X27-23 (DD29.9 DD29.10)
TCM_SPI_MOSIA_9: FPGA_SPI (DD6.D13), FIT_HDMI_X27-23 (DD31.4 DD31.5)
TCM_SPI_MOSIC_0: FPGA_SPI (DD6.H14), FIT_HDMI_X16-33 (DD18.1 DD18.2)
TCM_SPI_MOSIC_1: FPGA_SPI (DD6.C14), FIT_HDMI_X16-33 (DD18.12 DD18.13)
TCM_SPI_MOSIC_2: FPGA_SPI (DD6.J15), FIT_HDMI_X24-20 (DD19.9 DD19.10)
TCM_SPI_MOSIC_3: FPGA_SPI (DD6.D15), FIT_HDMI_X24-20 (DD21.4 DD21.5)
TCM_SPI_MOSIC_4: FPGA_SPI (DD6.K16), FIT_HDMI_X34-28 (DD22.1 DD22.2)
TCM_SPI_MOSIC_5: FPGA_SPI (DD6.E16), FIT_HDMI_X34-28 (DD22.12 DD22.13)
TCM_SPI_MOSIC_6: FPGA_SPI (DD6.M17), FIT_HDMI_X21-17 (DD25.9 DD25.10)
TCM_SPI_MOSIC_7: FPGA_SPI (DD6.G17), FIT_HDMI_X21-17 (DD27.4 DD27.5)
TCM_SPI_MOSIC_8: FPGA_SPI (DD6.B17), FIT_HDMI_X25-29 (DD32.1 DD32.2)
TCM_SPI_MOSIC_9: FPGA_SPI (DD6.J18), FIT_HDMI_X25-29 (DD32.12 DD32.13)
TCM_SPI_SELA_0: FPGA_SPI (DD6.D8), FIT_HDMI_X31-7 (DD42.1 DD42.2)
TCM_SPI_SELA_1: FPGA_SPI (DD6.F9), FIT_HDMI_X31-7 (DD42.12 DD42.13)
TCM_SPI_SELA_2: FPGA_SPI (DD6.A9), FIT_HDMI_X22-18 (DD2.9 DD2.10)
TCM_SPI_SELA_3: FPGA_SPI (DD6.E10), FIT_HDMI_X22-18 (DD3.4 DD3.5)
TCM_SPI_SELA_4: FPGA_SPI (DD6.J11), FIT_HDMI_X32-26 (DD4.1 DD4.2)
TCM_SPI_SELA_5: FPGA_SPI (DD6.D11), FIT_HDMI_X32-26 (DD4.12 DD4.13)
TCM_SPI_SELA_6: FPGA_SPI (DD6.G12), FIT_HDMI_X19-9 (DD24.9 DD24.10)
TCM_SPI_SELA_7: FPGA_SPI (DD6.B12), FIT_HDMI_X19-9 (DD26.4 DD26.5)
TCM_SPI_SELA_8: FPGA_SPI (DD6.F13), FIT_HDMI_X27-23 (DD29.1 DD29.2)
TCM_SPI_SELA_9: FPGA_SPI (DD6.A13), FIT_HDMI_X27-23 (DD29.12 DD29.13)
TCM_SPI_SELC_0: FPGA_SPI (DD6.F14), FIT_HDMI_X16-33 (DD31.9 DD31.10)
TCM_SPI_SELC_1: FPGA_SPI (DD6.A14), FIT_HDMI_X16-33 (DD18.4 DD18.5)
TCM_SPI_SELC_2: FPGA_SPI (DD6.F15), FIT_HDMI_X24-20 (DD19.1 DD19.2)
TCM_SPI_SELC_3: FPGA_SPI (DD6.A15), FIT_HDMI_X24-20 (DD19.12 DD19.13)
TCM_SPI_SELC_4: FPGA_SPI (DD6.H16), FIT_HDMI_X34-28 (DD21.9 DD21.10)
TCM_SPI_SELC_5: FPGA_SPI (DD6.C16), FIT_HDMI_X34-28 (DD22.4 DD22.5)
TCM_SPI_SELC_6: FPGA_SPI (DD6.K17), FIT_HDMI_X21-17 (DD25.1 DD25.2)
TCM_SPI_SELC_7: FPGA_SPI (DD6.E17), FIT_HDMI_X21-17 (DD25.12 DD25.13)
TCM_SPI_SELC_8: FPGA_SPI (DD6.L18), FIT_HDMI_X25-29 (DD27.9 DD27.10)
TCM_SPI_SELC_9: FPGA_SPI (DD6.F18), FIT_HDMI_X25-29 (DD32.4 DD32.5)
Vertex_N: FIT_TCM_LEMO_OUT (DD38.3), FIT_FPGA_E_G-H (DD6.W11)
Vertex_P: FIT_TCM_LEMO_OUT (DD38.2), FIT_FPGA_E_G-H (DD6.V11)